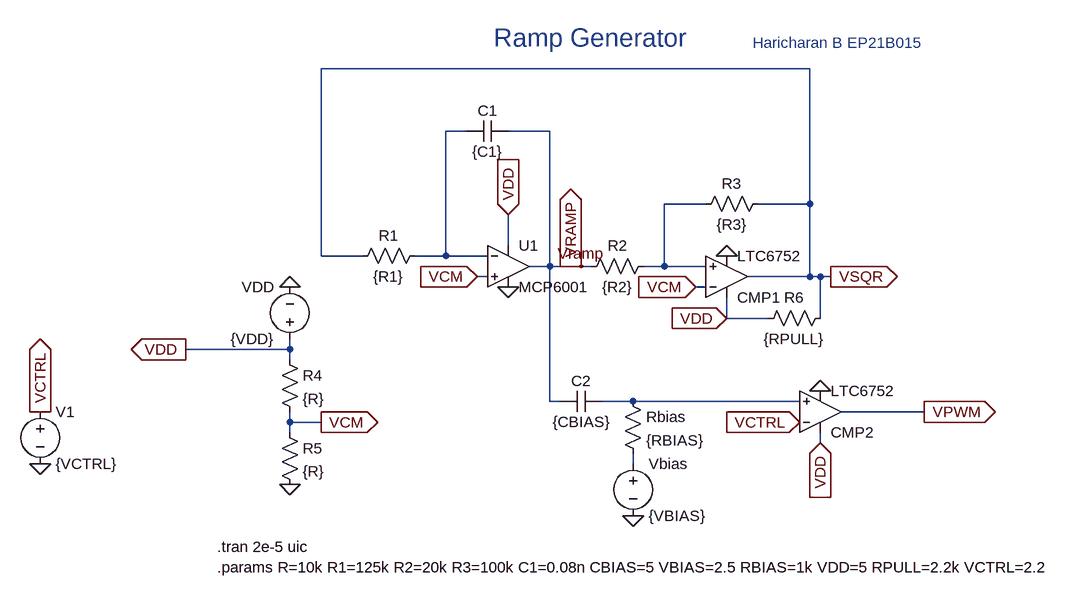
[diagram p0: schematic lab_expt_1.asc]
lab_expt_1.asc, the LTspice schematic file:
Version 4
SHEET 1 1476 680
WIRE 704 -192 -48 -192
WIRE 176 -96 144 -96
WIRE 304 -96 240 -96
WIRE 544 16 480 16
WIRE 704 16 704 -192
WIRE 704 16 624 16
WIRE 240 80 240 32
WIRE -48 96 -48 -192
WIRE 16 96 -48 96
WIRE 144 96 144 -96
WIRE 144 96 96 96
WIRE 208 96 144 96
WIRE 304 112 304 -96
WIRE 304 112 272 112
WIRE 336 112 304 112
WIRE 352 112 336 112
WIRE 368 112 352 112
WIRE 480 112 480 16
WIRE 480 112 448 112
WIRE 544 112 480 112
WIRE 208 128 192 128
WIRE 704 128 704 16
WIRE 704 128 608 128
WIRE 720 128 704 128
WIRE 736 128 720 128
WIRE 544 144 528 144
WIRE 576 192 576 160
WIRE 640 192 576 192
WIRE 720 192 720 128
WIRE -96 240 -96 224
WIRE -96 240 -256 240
WIRE -96 256 -96 240
WIRE 304 320 304 112
WIRE 320 320 304 320
WIRE 432 320 384 320
WIRE 688 320 432 320
WIRE 880 336 752 336
WIRE -96 352 -96 336
WIRE -48 352 -96 352
WIRE -96 368 -96 352
WIRE 720 384 720 368
WIRE 432 416 432 400
FLAG -96 448 0
FLAG -48 352 VCM
IOPIN -48 352 Out
FLAG -96 144 0
FLAG 192 128 VCM
IOPIN 192 128 In
FLAG 528 144 VCM
IOPIN 528 144 In
FLAG 240 144 0
FLAG 576 96 0
FLAG 720 304 0
FLAG 432 496 0
FLAG -256 240 VDD
IOPIN -256 240 Out
FLAG 240 32 VDD
IOPIN 240 32 In
FLAG 576 192 VDD
IOPIN 576 192 In
FLAG 720 384 VDD
IOPIN 720 384 In
FLAG 736 128 VSQR
IOPIN 736 128 Out
FLAG 880 336 VPWM
IOPIN 880 336 Out
FLAG 352 112 Vramp
FLAG -480 336 VCTRL
IOPIN -480 336 Out
FLAG 688 352 VCTRL
IOPIN 688 352 In
FLAG 336 112 VRAMP
IOPIN 336 112 Out
FLAG -480 416 0
SYMBOL res 112 80 R90
WINDOW 0 0 56 VBottom 2
WINDOW 3 32 56 VTop 2
SYMATTR InstName R1
SYMATTR Value {R1}
SYMBOL cap 240 -112 R90
WINDOW 0 0 32 VBottom 2
WINDOW 3 32 32 VTop 2
SYMATTR InstName C1
SYMATTR Value {C1}
SYMBOL cap 384 304 R90
WINDOW 0 0 32 VBottom 2
WINDOW 3 32 32 VTop 2
SYMATTR InstName C2
SYMATTR Value {CBIAS}
SYMBOL res 416 304 R0
SYMATTR InstName Rbias
SYMATTR Value {RBIAS}
SYMBOL res 464 96 R90
WINDOW 0 0 56 VBottom 2
WINDOW 3 32 56 VTop 2
SYMATTR InstName R2
SYMATTR Value {R2}
SYMBOL Comparators\\LTC6752 576 192 M180
SYMATTR InstName CMP1
SYMBOL Comparators\\LTC6752 720 400 M180
SYMATTR InstName CMP2
SYMBOL res 640 0 R90
WINDOW 0 0 56 VBottom 2
WINDOW 3 32 56 VTop 2
SYMATTR InstName R3
SYMATTR Value {R3}
SYMBOL res -112 352 R0
SYMATTR InstName R5
SYMATTR Value {R}
SYMBOL res -112 240 R0
SYMATTR InstName R4
SYMATTR Value {R}
SYMBOL voltage -96 240 R180
WINDOW 0 24 96 Left 2
WINDOW 3 24 16 Left 2
SYMATTR InstName VDD
SYMATTR Value {VDD}
SYMBOL voltage 432 400 R0
SYMATTR InstName Vbias
SYMATTR Value {VBIAS}
SYMBOL ZZZ\\OpAmp\\MCP6001 240 48 R0
SYMATTR InstName U1
SYMBOL res 736 176 R90
WINDOW 0 0 56 VBottom 2
WINDOW 3 32 56 VTop 2
SYMATTR InstName R6
SYMATTR Value {RPULL}
SYMBOL voltage -480 320 R0
SYMATTR InstName V1
SYMATTR Value {VCTRL}
TEXT -208 544 Left 2 !.tran 2e-5 uic\n.params R=10k R1=125k R2=20k R3=100k C1=0.08n CBIAS=5 VBIAS=2.5 RBIAS=1k VDD=5 RPULL=2.2k VCTRL=2.2
TEXT 368 -240 Center 4 ;Ramp Generator
TEXT 616 -232 Left 2 ;Haricharan B EP21B015

The netlist it stands for:
* lab_expt_1.asc
R1 N001 VSQR {R1}
C1 Vramp N001 {C1}
C2 N003 Vramp {CBIAS}
Rbias N003 N004 {RBIAS}
R2 N002 Vramp {R2}
XCMP1 N002 VCM VDD 0 VSQR LTC6752  ; pins In+ In- V+ V- OUT
XCMP2 N003 VCTRL VDD 0 VPWM LTC6752  ; pins In+ In- V+ V- OUT
R3 VSQR N002 {R3}
R5 VCM 0 {R}
R4 VDD VCM {R}
VDD VDD 0 {VDD}
Vbias N004 0 {VBIAS}
* U1: MCP6001 (symbol ZZZ\OpAmp\MCP6001 not available, pins judged from their places): In+=VCM In-=N001 V+=VDD V-=0 OUT=Vramp
R6 VSQR VDD {RPULL}
V1 VCTRL 0 {VCTRL}
.tran 2e-5 uic
.params R=10k R1=125k R2=20k R3=100k C1=0.08n CBIAS=5 VBIAS=2.5 RBIAS=1k VDD=5 RPULL=2.2k VCTRL=2.2
* Ramp Generator
* Haricharan B EP21B015
.lib LTC7.lib
.backanno
.end